# EAGLE design MADcomboV2 (EAGLE 9.5.1)
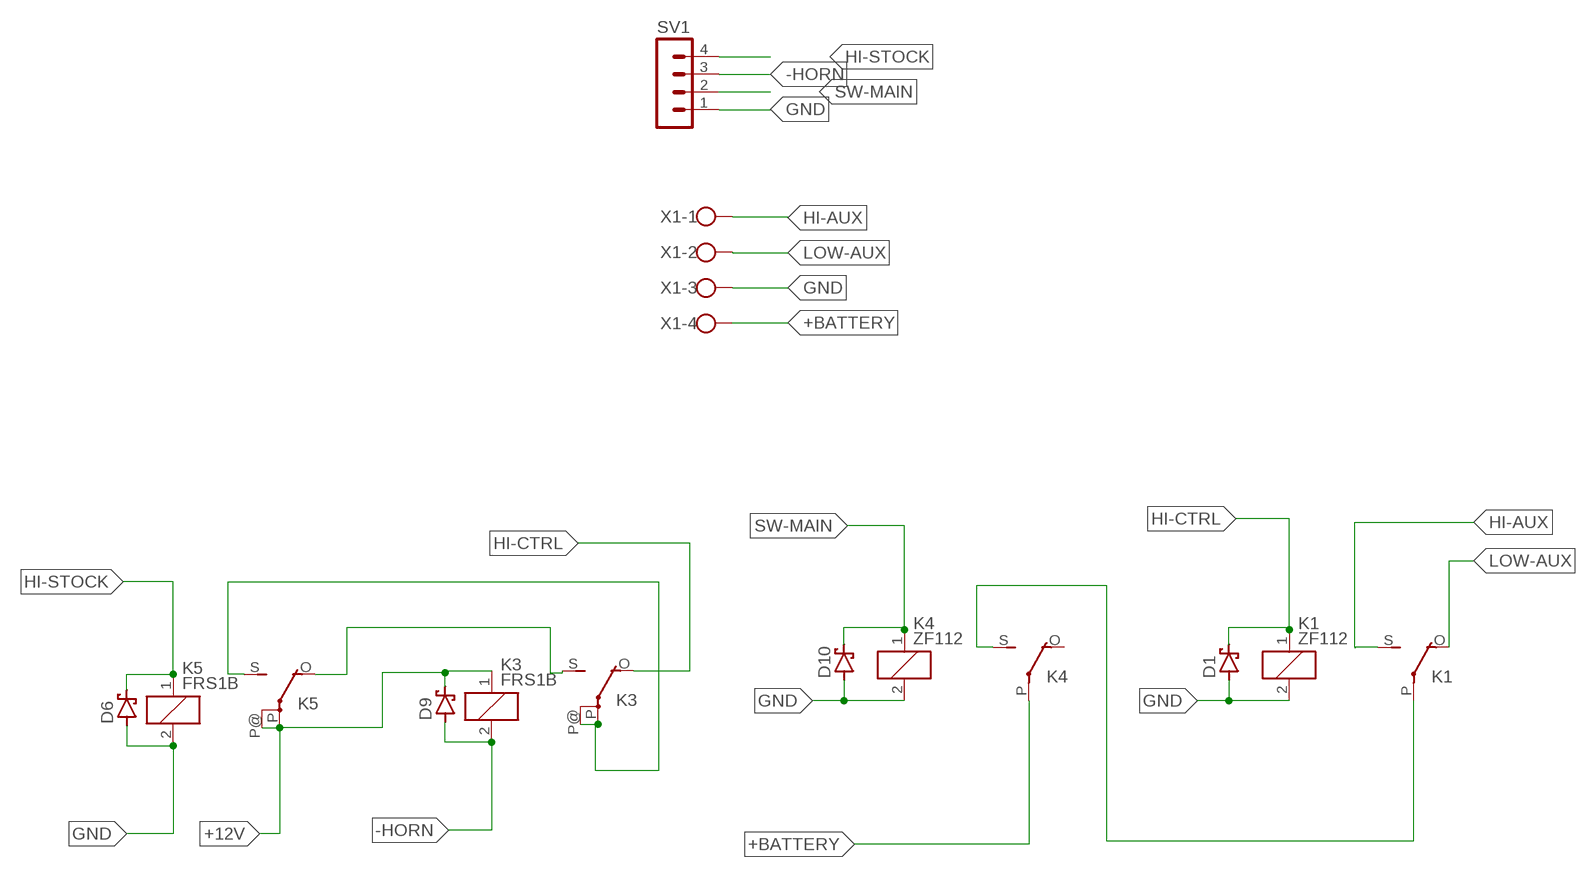
[diagram p0: schematic, sheet 1]

## Parts
D1  SCHOTTKY-DIODESMD  [SMB]
D6  SCHOTTKY-DIODESMD  [SMB]
D9  SCHOTTKY-DIODESMD  [SMB]
D10  SCHOTTKY-DIODESMD  [SMB]
K1  ZF112  [ZF112]
K3  FRS1B  [FRS1B]
K4  ZF112  [ZF112]
K5  FRS1B  [FRS1B]
SV1  MA04-1  [MA04-1]
X1  W237-4  [W237-4]

## Nets
+12V: D9.C K3.1 K5.P(2:P) K5.P@(2:P)
+BATTERY: K4.P(2:P) X1.4
-HORN: D9.A K3.2 SV1.3
GND: D1.A D6.A D10.A K1.2 K4.2 K5.2 SV1.1 X1.3
HI-AUX: K1.S(2:S) X1.1
HI-CTRL: D1.C K1.1 K3.O(2:O)
HI-STOCK: D6.C K5.1 SV1.4
LOW-AUX: K1.O(2:O) X1.2
N$1: K3.P(2:P) K3.P@(2:P) K5.S(2:S)
N$2: K3.S(2:S) K5.O(2:O)
N$7: K1.P(2:P) K4.S(2:S)
SW-MAIN: D10.C K4.1 SV1.2
Unconnected: K4.O(2:O)

## Library data of the parts
D1 D6 D9 D10 = diode:SCHOTTKY-DIODE: Schottky Diode
K1 K4 = relay:ZF112: RELAY 1 x switch; OC_FARNELL: unknown; OC_NEWARK: unknown
K3 K5 = relay:FRS1B: RELAY 1 x switch, same as V23101-D6-A201, Siemens; OC_FARNELL: unknown; OC_NEWARK: unknown
SV1 = con-lstb:MA04-1: PIN HEADER; OC_FARNELL: unknown; OC_NEWARK: unknown
X1 = con-wago-500:W237-4: WAGO SCREW CLAMP; OC_FARNELL: unknown; OC_NEWARK: unknown

## Board
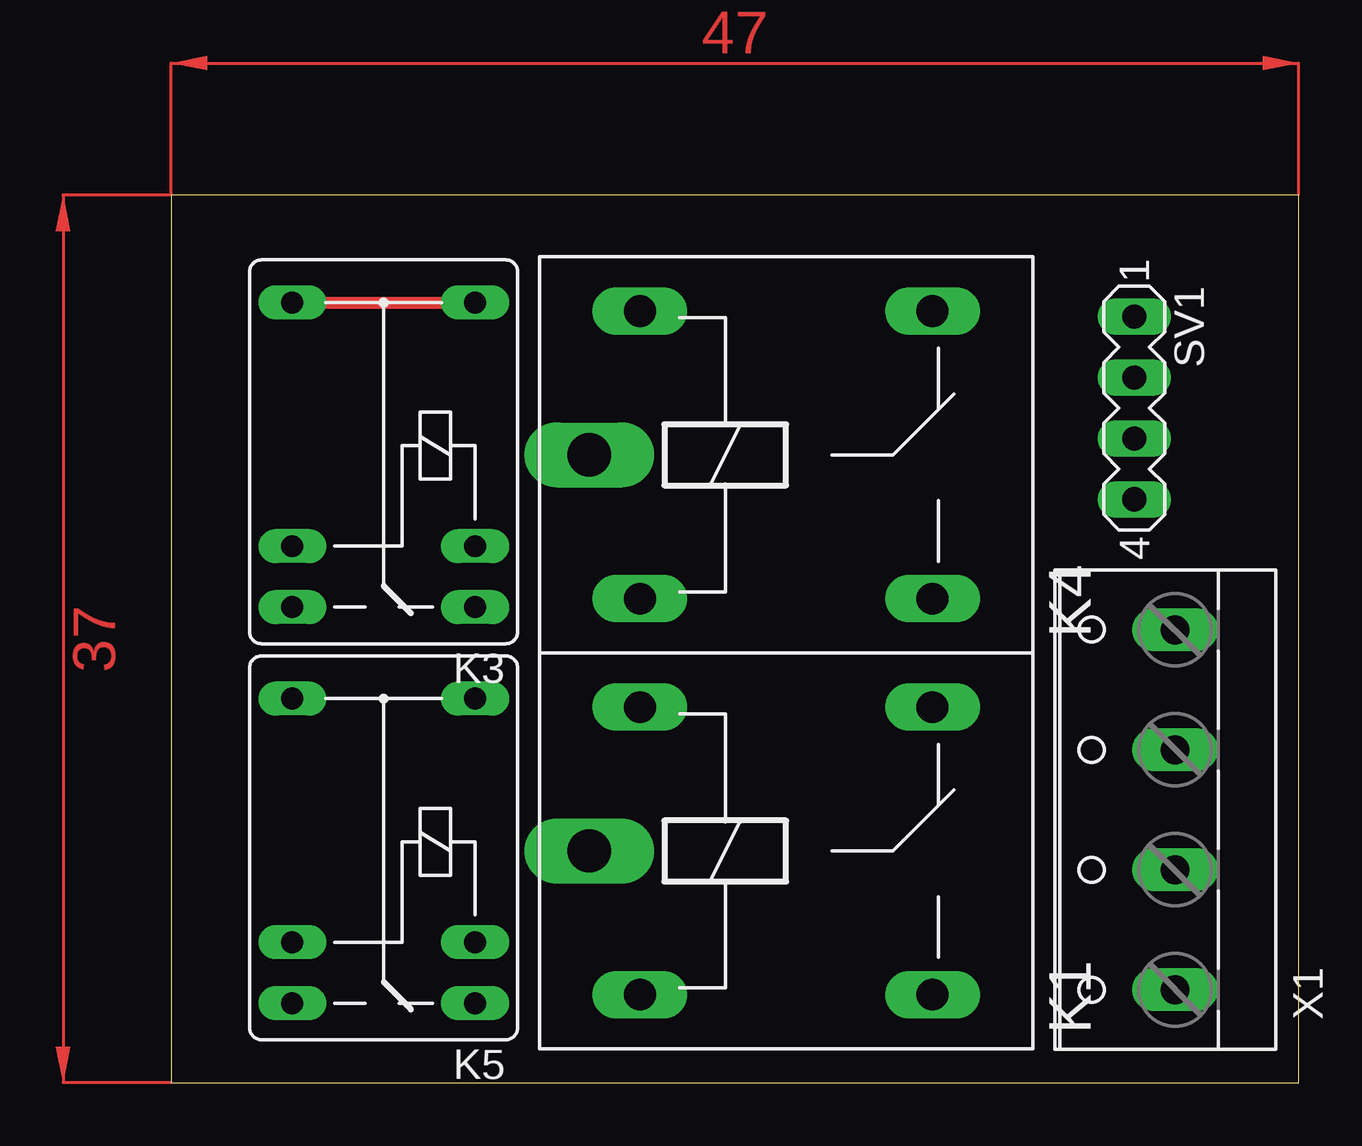
[diagram p1: board, top side]
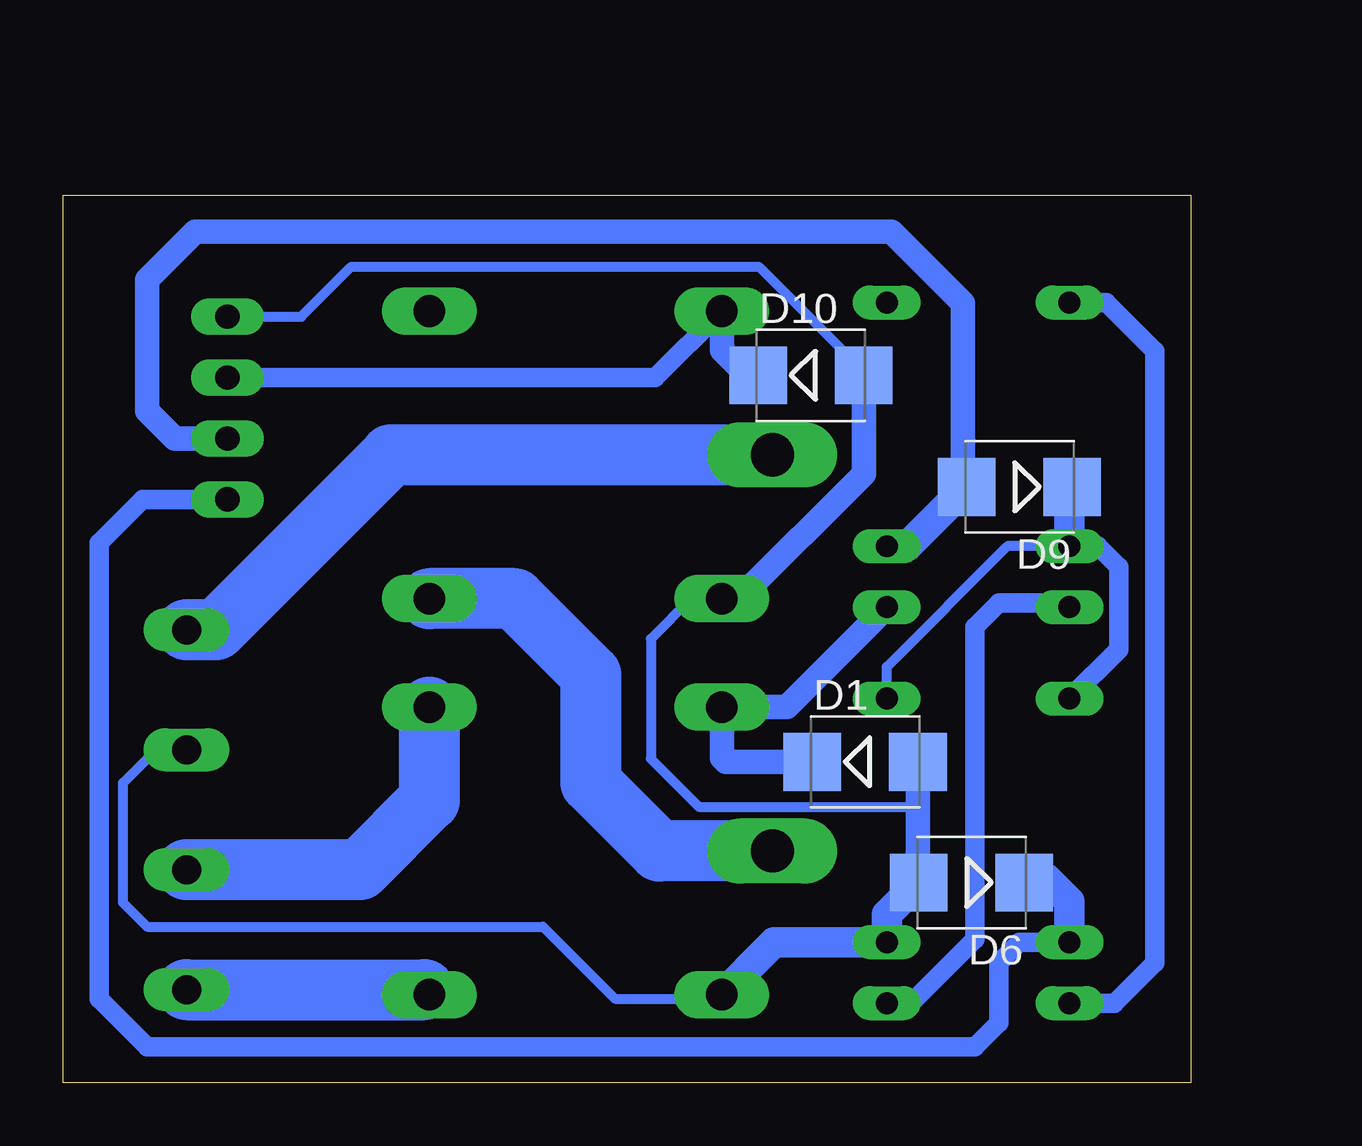
[diagram p2: board, bottom side, seen from below]

Size 47 x 37 mm. Coordinates in mm from the lower left corner, seen from the top.
Outline: 0,0 47,0 47,37 0,37 0,0
Copper layers (1*16): Top 0.035mm / dielectric 1.5mm / Bottom 0.035mm
Design rules "default": minimum track width 6mil, minimum drill 0.35mm, track to track 6mil, track to pad 6mil, pad to pad 6mil, via to via 6mil, smd to smd 6mil, copper to edge 40mil, drill to drill 6mil, minimum pad ring 10mil, minimum via ring 8mil, stop-mask expansion 4mil, vias tented up to drill 0mil, thermal gap 10mil

### Footprints (pad centres in the part's own frame; a part is rotated, then mirrored left to right if it is on the bottom)
SMB = smd 2.4 x 2.4: A 2.2,0; C -2.2,0
ZF112 = drill 1.321 long: 1 -6.096,5.994; 2 -6.096,-5.994; O 6.096,5.994; S 6.096,-5.994 | drill 1.803 long: P -8.204,0
FRS1B = drill 0.914 long: 1 0,3.81; 2 0,-3.81; O -2.54,-3.81; P 10.16,3.81; P@ 10.16,-3.81; S -2.54,3.81
MA04-1 = drill 1.016 long: 1 -3.81,0; 2 -1.27,0; 3 1.27,0; 4 3.81,0
W237-4 = drill 1.194 long: 1 -7.5,-1.27; 2 -2.5,-1.27; 3 2.5,-1.27; 4 7.5,-1.27

### Placement (x,y rotation side)
D1  13.57,13.37 0 bottom
D6  9.14,8.34 180 bottom
D9  7.14,24.83 180 bottom
D10  15.83,29.49 0 bottom
K1  25.64,9.66 0 top
K3  8.86,22.36 90 top
K4  25.64,26.17 0 top
K5  8.86,5.85 90 top
SV1  40.15,28.12 270 top
X1  40.58,11.37 90 top

### Tracks (layer width: path | path; a pad name or v marks a point on that pad's centre or on a via)
+12V
  Bottom 0.406: K3.1 7.64,22.36 12.67,17.33 K5.P@
  Bottom 0.813: K5.P 3,18.06 3,21.5 3.86,22.36 K3.1
  Bottom 1.27: K3.1 5.05,24.72 D9.C
+BATTERY
  Bottom 2.54: K4.P 33.33,26.17 40.63,18.87 X1.4
-HORN
  Bottom 1.016: D9.A 9.5,24.99 9.5,32.5 12.48,35.48 41.5,35.48 43.5,33.48 43.5,28 42.35,26.85 SV1.3
  Bottom 1.27: K3.2 11.81,22.36 D9.A
GND
  Bottom 0.406: K4.2 20.82,20.18 22.5,18.5 22.5,13.5 20.5,11.5 11.37,11.5 | X1.3 41.98,14 43,14 44.5,12.5 44.5,7.5 43.5,6.5 27,6.5 24,3.5 19.71,3.5 K1.2 | SV1.1 37.07,31.93 34.99,34.01 18,34.01 13.63,29.64 D10.A
  Bottom 1.016: D1.A 11.37,11.5 11.37,8.37 D6.A | D10.A 13.63,25.37 18.82,20.18 K4.2
  Bottom 1.27: D6.A 12.67,7.01 K5.2 17.36,5.85 19.71,3.5
HI-AUX
  Bottom 1.27: 31.94,3.87 K1.S
  Bottom 2.54: X1.1 31.94,3.87
HI-CTRL
  Bottom 1.016: K3.O 16.84,15.65 K1.1 19.54,13.54 19.37,13.37 D1.C
HI-STOCK
  Bottom 0.813: SV1.4 43.69,24.31 45.5,22.5 45.5,3.5 43.5,1.5 9,1.5 8,2.5 8,5 7.15,5.85 K5.1
  Bottom 1.27: K5.1 5.05,7.55 6,8.5 6.78,8.5 D6.C
LOW-AUX
  Bottom 2.54: K1.O 31.74,11.76 34.63,8.87 X1.2
N$1
  Top 0.508: K3.P K3.P@
  Bottom 0.813: K5.S 3.19,3.31 1.5,5 1.5,30.5 3.52,32.52 K3.P
N$2
  Bottom 0.813: K5.O 11.67,3.31 9,5.98 9,19 8,20 5.23,20 K3.S
N$7
  Bottom 2.54: K1.P 22.16,9.66 25,12.5 25,17 28.18,20.18 K4.S
SW-MAIN
  Bottom 0.813: K4.1 22.32,29.39 SV1.2
  Bottom 1.016: D10.C 18.49,29.49 19.54,30.54 K4.1
(copper drawn outside any net)
  shapes: Top area x2